# EasyEDA Pro project ProPrj_KrabbyUno - v0.1_2026-05-19.epro, board PCB1
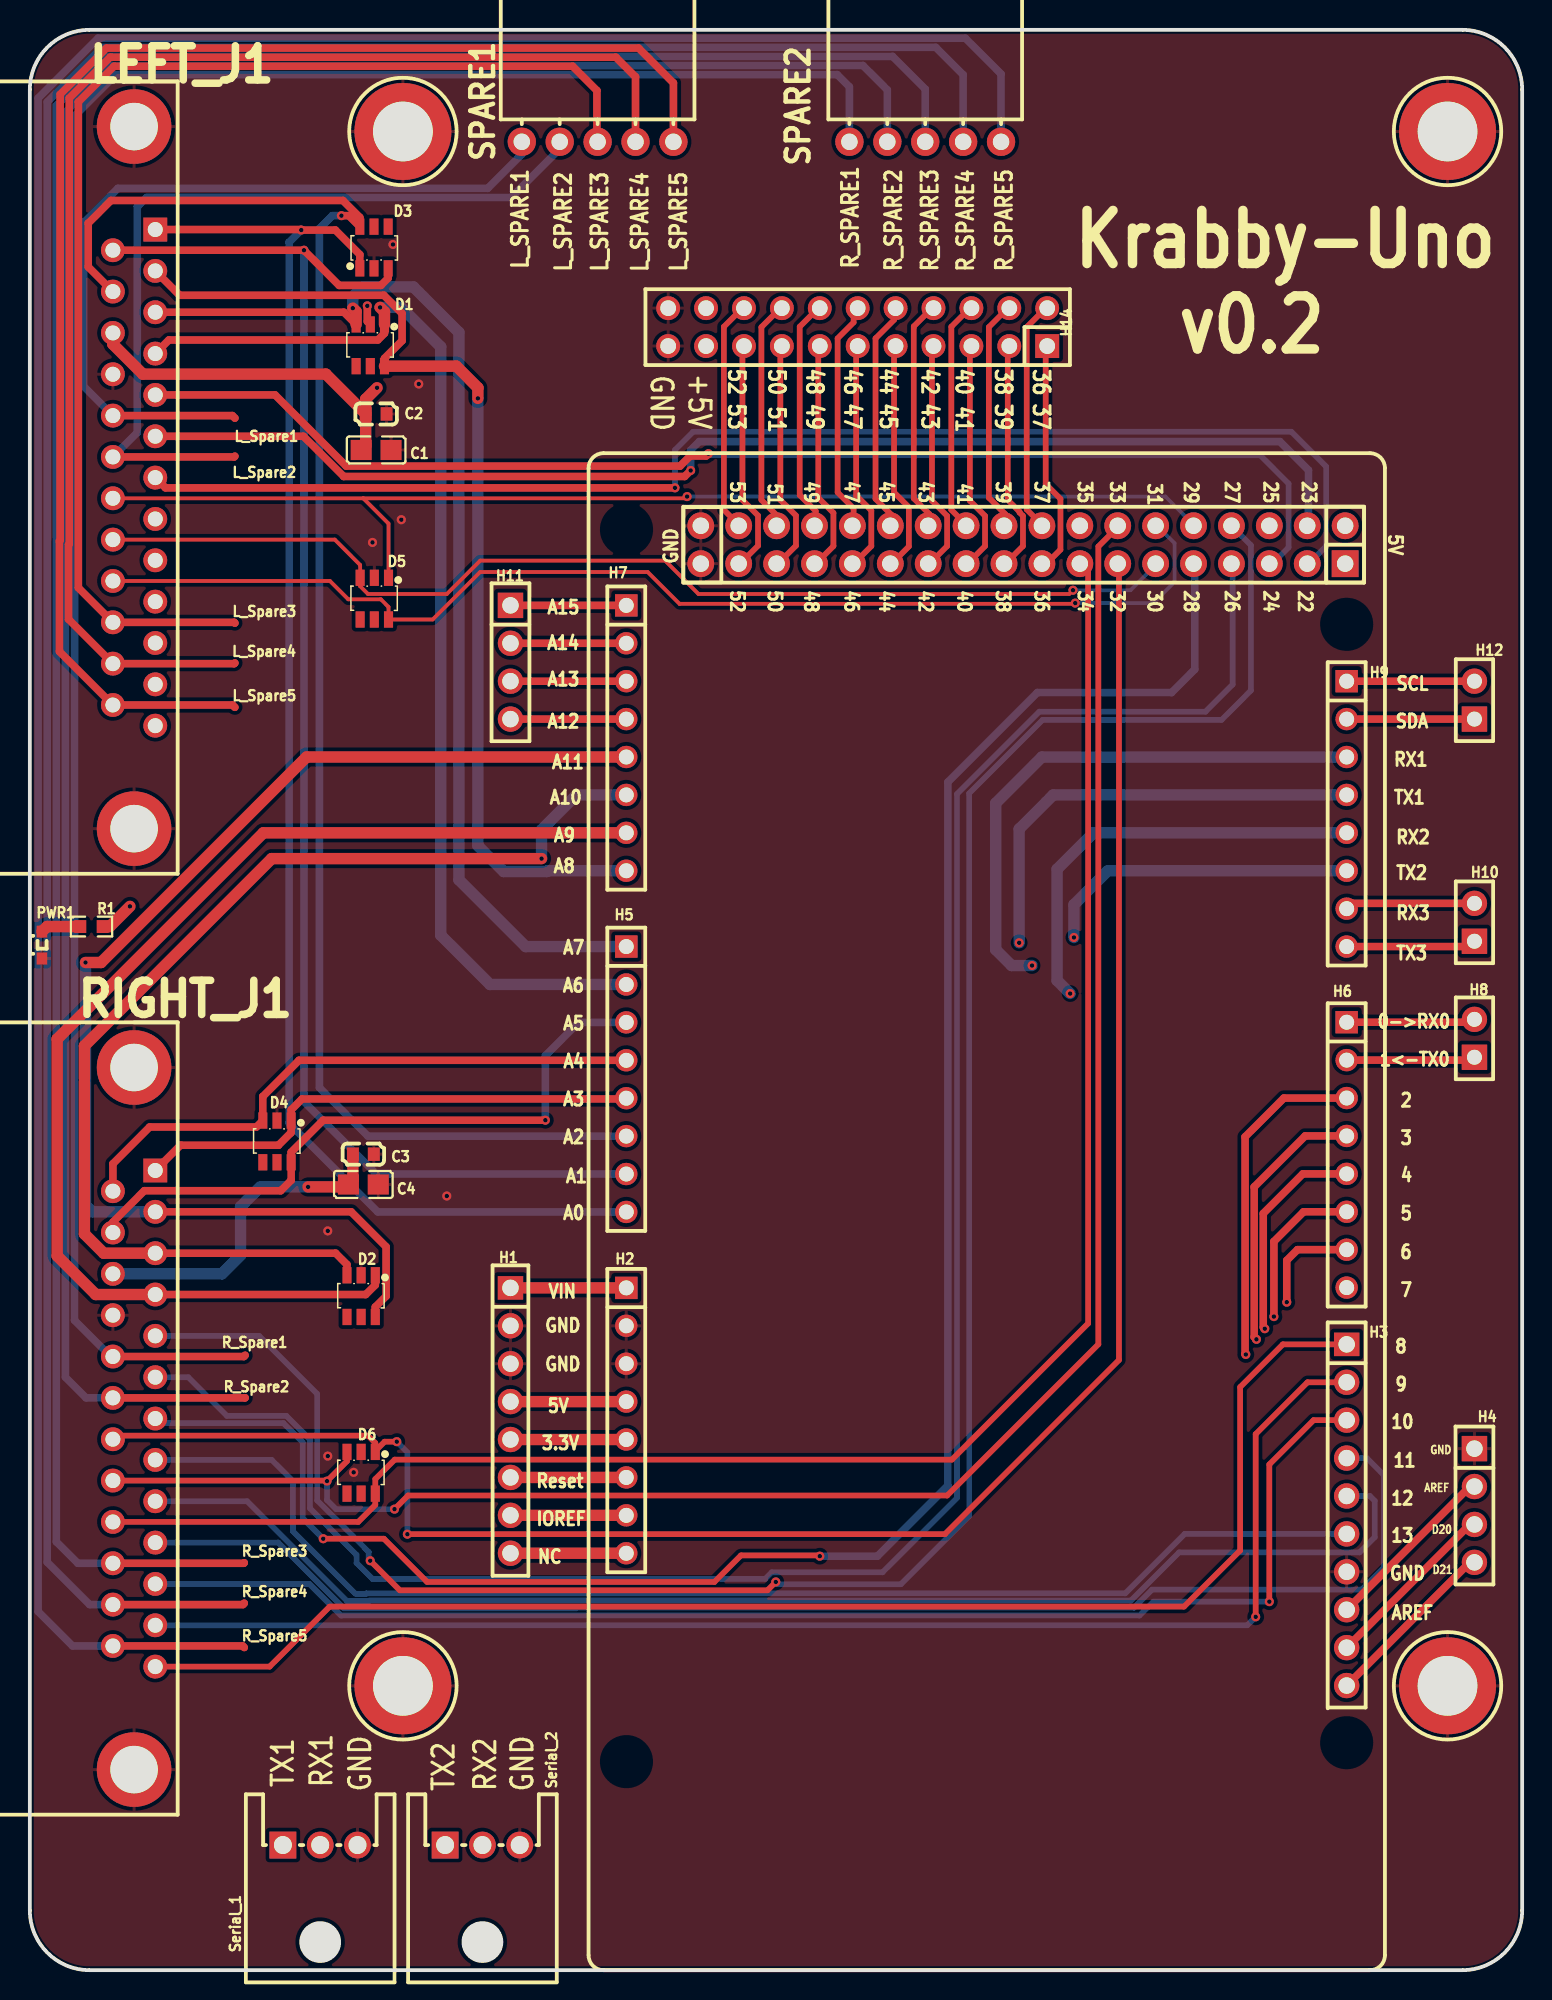
[diagram p6: board, top side]
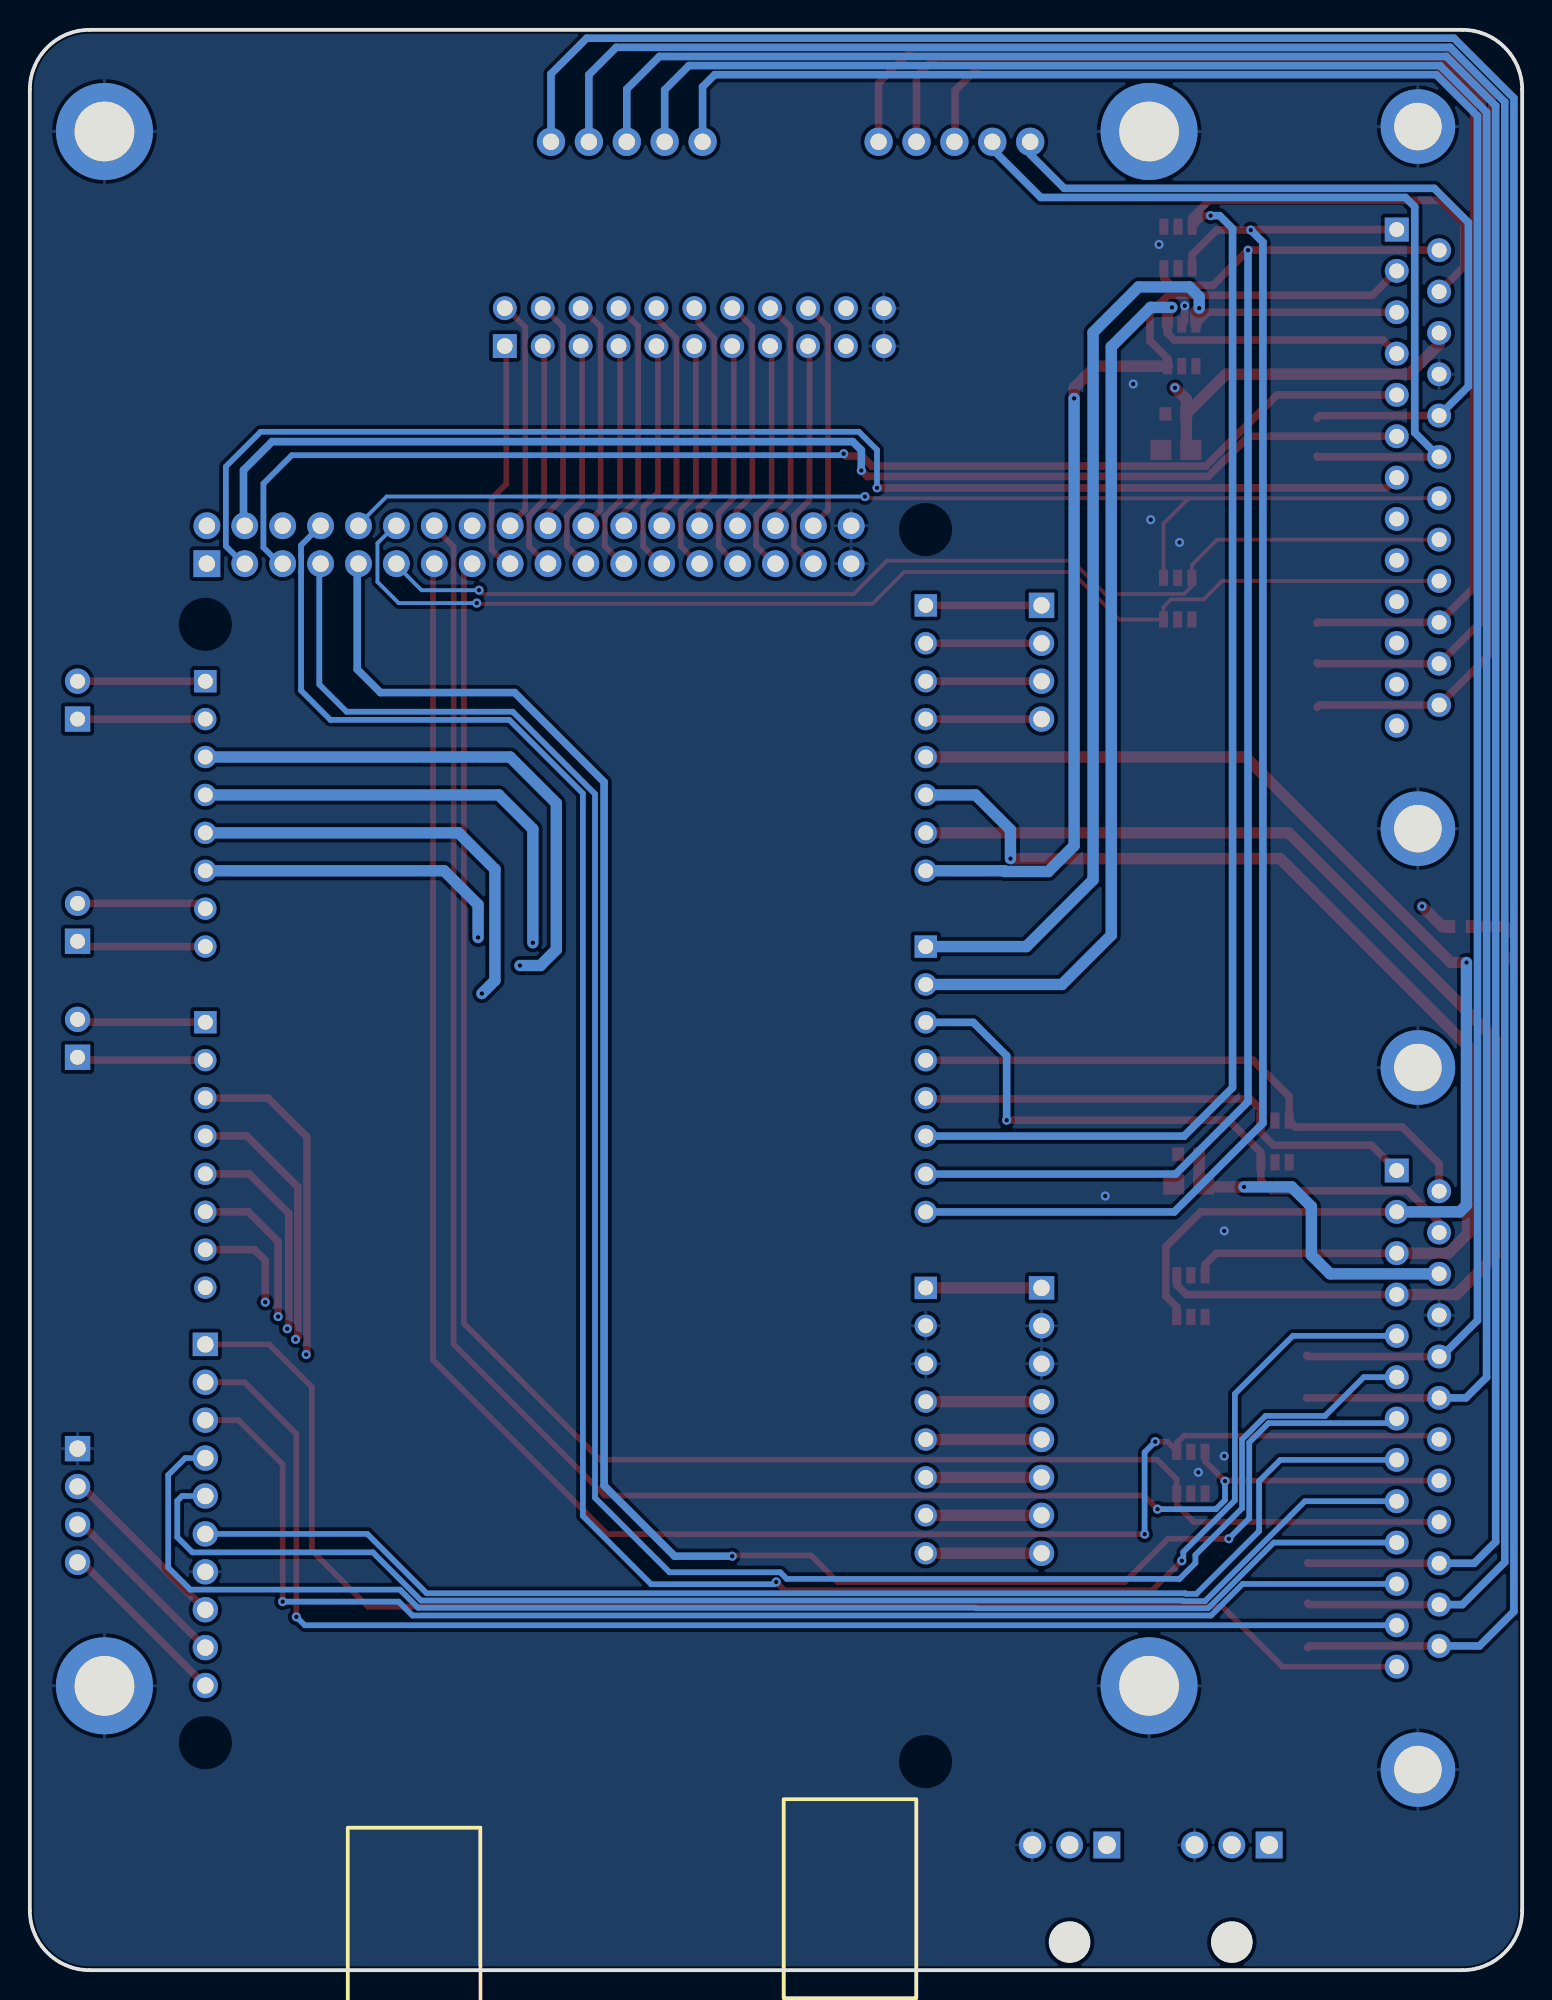
[diagram p7: board, bottom side, seen from below]

Outline 100 x 130 mm; copper layers: Top Layer, Inner1, Inner2, Bottom Layer. Coordinates in mm from the lower left corner of the outline.
Outline path: 0,126 0,4 arc(1.17,1.17) 4,0 96,0 arc(98.83,1.17) 100,4 100,126 arc(98.83,128.83) 96,130 4,130 arc(1.17,128.83) 0,126
Stack: Top Layer 0.035mm Outer layer thickness 1oz / Dielectric1 0.2104mm 7628 RC49% 8.6mil / Inner1 0.0152mm Inner layer thickness / Dielectric2 1.065mm 1.1mm H/HOZ Copper / Inner2 0.0152mm Inner layer thickness / Dielectric3 0.2104mm 7628 RC49% 8.6mil / Bottom Layer 0.035mm Outer layer thickness 1oz

## Design rules (mm)
template: JLCPCB Capability(Two Layers Board)
spacing copperThickness1oz (default): track to track 0.102, other pairs 0.152 to 0.3
spacing copperThickness2oz: track to track 0.203, other pairs 0.152 to 0.3
track width copperThickness1oz (default): min 0.127, default 0.254, max 2.54
track width copperThickness2oz: min 0.203, default 0.254, max 2.54
differential pair differentialPair (default): width min 0.127, default 0.254, max 2.54; gap min 0.152, default 0.152
via viaSize (default): diameter min 0.5, default 0.61, max 10; hole min 0.3, default 0.305, max 6.3

## Placement (name value [footprint] x y rotation side)
C1  4.7uF  [C0805]  23.21 101.85 180 top
C2  100nF  [C0603]  23.21 104.27 0 top
C3  100nF  [C0603]  22.35 54.67 0 top
C4  4.7uF  [C0805]  22.35 52.64 180 top
D1  PESD5V0S5UD,115  [SC-74-6_L3.0-W1.5-P0.95-LS2.8-BL]  22.81 108.86 180 top
D2  PESD5V0S5UD,115  [SC-74-6_L3.0-W1.5-P0.95-LS2.8-BL]  22.2 45.16 180 top
D3  PESD5V0S5UD,115  [SC-74-6_L3.0-W1.5-P0.95-LS2.8-BL]  23.06 115.42 0 top
D4  PESD5V0S5UD,115  [SC-74-6_L3.0-W1.5-P0.95-LS2.8-BL]  16.56 55.52 180 top
D5  PESD5V0S5UD,115  [SC-74-6_L3.0-W1.5-P0.95-LS2.8-BL]  23.08 91.89 180 top
D6  PESD5V0S5UD,115  [SC-74-6_L3.0-W1.5-P0.95-LS2.8-BL]  22.2 33.32 180 top
H1  PM254-1-08-Z-8.5  [HDR-TH_8P-P2.54-V-F]  32.21 36.82 270 top
H2  PZ254V-11-08P  [HDR-TH_8P-P2.54-V-M]  39.97 36.82 270 top
H3  PZ254V-11-10P  [HDR-TH_10P-P2.54-V-M]  88.24 30.5 270 top
H4  PM254-1-04-Z-8.5  [HDR-TH_4P-P2.54-V-F]  96.8 31.13 270 top
H5  PZ254V-11-08P  [HDR-TH_8P-P2.54-V-M]  39.97 59.69 270 top
H6  PZ254V-11-08P  [HDR-TH_8P-P2.54-V-M]  88.24 54.62 270 top
H7  PZ254V-11-08P  [HDR-TH_8P-P2.54-V-M]  39.97 82.55 270 top
H8  PM254-1-02-Z-8.5  [HDR-TH_2P-P2.54-V-F]  96.8 62.43 90 top
H9  PZ254V-11-08P  [HDR-TH_8P-P2.54-V-M]  88.24 77.47 270 top
H10  PM254-1-02-Z-8.5  [HDR-TH_2P-P2.54-V-F]  96.8 70.21 90 top
H11  PM254-1-04-Z-8.5  [HDR-TH_4P-P2.54-V-F]  32.21 87.63 270 top
H12  PM254-1-02-Z-8.5  [HDR-TH_2P-P2.54-V-F]  96.8 85.09 90 top
H13  PZ254-2-18-Z-8.5  [HDR-TH_36P-P2.54-V-M-R2-C18-S2.54]  66.55 95.5 0 top
H14  PM254-2-11-Z-8.5  [HDR-TH_22P-P2.54-V-F-R2-C11-S2.54]  55.47 110.08 0 top
L_Spare1  -  [Test-Point-0.5mm]  13.74 103.99 90 top
L_Spare2  -  [Test-Point-0.5mm]  13.74 101.43 90 top
L_Spare3  -  [Test-Point-0.5mm]  13.74 90.25 0 top
L_Spare4  -  [Test-Point-0.5mm]  13.74 87.58 0 top
L_Spare5  -  [Test-Point-0.5mm]  13.74 84.61 0 top
LEFT_J1  D-DMR025PM-D002  [DB25-TH_DMR025PM000XH00]  6.98 100 270 top
M1  SMTSO2025CTJ  [SMD-1_BD6.2-D3.6]  25 123.19 270 top
M2  SMTSO2025CTJ  [SMD-1_BD6.2-D3.6]  25 19.05 270 top
M3  SMTSO2025CTJ  [SMD-1_BD6.2-D3.6]  95 123.19 270 top
M4  SMTSO2025CTJ  [SMD-1_BD6.2-D3.6]  95 19.05 270 top
PWR1  LTST-S270TGKT  [LED-SMD_L1.7-W0.6-RD_GREEN]  0.81 68.68 90 top
R1  4.7K  [R0603]  4.13 69.92 180 top
R_Spare1  -  [Test-Point-0.5mm]  14.42 41.19 90 top
R_Spare2  -  [Test-Point-0.5mm]  14.42 38.35 90 top
R_Spare3  -  [Test-Point-0.5mm]  14.37 27.29 0 top
R_Spare4  -  [Test-Point-0.5mm]  14.37 24.58 0 top
R_Spare5  -  [Test-Point-0.5mm]  14.37 21.62 0 top
RIGHT_J1  D-DMR025PM-D002  [DB25-TH_DMR025PM000XH00]  6.98 36.96 270 top
Serial_1  S03B-XASK-1(LF)(SN)  [CONN-TH_S03B-XASK-1]  19.46 8.38 0 top
Serial_2  S03B-XASK-1(LF)(SN)  [CONN-TH_S03B-XASK-1]  30.33 8.38 0 top
SPARE1  BX-PM2.54-1-5PWZ  [HDR-TH_5P-P2.54-H-F-W10.0-N]  38.05 122.5 180 top
SPARE2  BX-PM2.54-1-5PWZ  [HDR-TH_5P-P2.54-H-F-W10.0-N]  60 122.5 180 top

## Footprints (pads in the part's own frame, mm; a bottom-side part is the same pattern mirrored in y, then rotated)
C0603
  rect 0.8x0.9 smd: 1(-0.7,0) 2(0.7,0)
C0805
  rect 1.41x1.35 smd: 1(-1,0) 2(1,0)
CONN-TH_S03B-XASK-1
  rect 1.8x1.8 hole 1.2: 1(-2.5,0)
  round 1.8 hole 1.2: 2(0,0) 3(2.5,0)
DB25-TH_DMR025PM000XH00
  rect 1.6x1.6 hole 1: 1(-16.62,1.42)
  round 1.6 hole 1: 2(-13.85,1.42) 3(-11.08,1.42) 4(-8.31,1.42) 5(-5.54,1.42) 6(-2.77,1.42) 7(0,1.42) 8(2.77,1.42) 9(5.54,1.42) 10(8.31,1.42) 11(11.08,1.42) 12(13.85,1.42) 13(16.62,1.42) 14(-15.235,-1.42) 15(-12.465,-1.42) 16(-9.695,-1.42) 17(-6.925,-1.42) 18(-4.155,-1.42) 19(-1.385,-1.42) 20(1.385,-1.42) 21(4.155,-1.42) 22(6.925,-1.42) 23(9.695,-1.42) 24(12.465,-1.42) 25(15.235,-1.42)
  round 5 hole 3.18: 26(23.52,0) 27(-23.52,0)
HDR-TH_2P-P2.54-V-F
  rect 1.7x1.7 hole 1: 1(-1.27,0)
  round 1.7 hole 1: 2(1.27,0)
HDR-TH_4P-P2.54-V-F
  rect 1.7x1.7 hole 1.1: 1(-3.81,0)
  round 1.7 hole 1.1: 2(-1.27,0) 3(1.27,0) 4(3.81,0)
HDR-TH_5P-P2.54-H-F-W10.0-N
  round 1.9 hole 1.1: 1(-5.08,0) 2(-2.54,0) 3(0,0) 4(2.54,0) 5(5.08,0)
HDR-TH_8P-P2.54-V-F
  rect 1.575x1.7 hole 1.1: 1(-8.89,0)
  round 1.7 hole 1.1: 2(-6.35,0) 3(-3.81,0) 4(-1.27,0) 5(1.27,0) 6(3.81,0) 7(6.35,0) 8(8.89,0)
HDR-TH_8P-P2.54-V-M
  rect 1.5x1.5 hole 1: 1(-8.89,0)
  round 1.5 hole 1: 2(-6.35,0) 3(-3.81,0) 4(-1.27,0) 5(1.27,0) 6(3.81,0) 7(6.35,0) 8(8.89,0)
HDR-TH_10P-P2.54-V-M
  rect 1.575x1.7 hole 1.1: 1(-11.43,0)
  round 1.7 hole 1.1: 2(-8.89,0) 3(-6.35,0) 4(-3.81,0) 5(-1.27,0) 6(1.27,0) 7(3.81,0) 8(6.35,0) 9(8.89,0) 10(11.43,0)
HDR-TH_22P-P2.54-V-F-R2-C11-S2.54
  rect 1.6x1.6 hole 1.05: 1(12.7,-1.27)
  round 1.6 hole 1.05: 2(12.7,1.27) 3(10.16,-1.27) 4(10.16,1.27) 5(7.62,-1.27) 6(7.62,1.27) 7(5.08,-1.27) 8(5.08,1.27) 9(2.54,-1.27) 10(2.54,1.27) 11(0,-1.27) 12(0,1.27) 13(-2.54,-1.27) 14(-2.54,1.27) 15(-5.08,-1.27) 16(-5.08,1.27) 17(-7.62,-1.27) 18(-7.62,1.27) 19(-10.16,-1.27) 20(-10.16,1.27) 21(-12.7,-1.27) 22(-12.7,1.27)
HDR-TH_36P-P2.54-V-M-R2-C18-S2.54
  rect 1.8x1.8 hole 1.1: 1(21.59,-1.27)
  round 1.8 hole 1.1: 2(21.59,1.27) 3(19.05,-1.27) 4(19.05,1.27) 5(16.51,-1.27) 6(16.51,1.27) 7(13.97,-1.27) 8(13.97,1.27) 9(11.43,-1.27) 10(11.43,1.27) 11(8.89,-1.27) 12(8.89,1.27) 13(6.35,-1.27) 14(6.35,1.27) 15(3.81,-1.27) 16(3.81,1.27) 17(1.27,-1.27) 18(1.27,1.27) 19(-1.27,-1.27) 20(-1.27,1.27) 21(-3.81,-1.27) 22(-3.81,1.27) 23(-6.35,-1.27) 24(-6.35,1.27) 25(-8.89,-1.27) 26(-8.89,1.27) 27(-11.43,-1.27) 28(-11.43,1.27) 29(-13.97,-1.27) 30(-13.97,1.27) 31(-16.51,-1.27) 32(-16.51,1.27) 33(-19.05,-1.27) 34(-19.05,1.27) 35(-21.59,-1.27) 36(-21.59,1.27)
LED-SMD_L1.7-W0.6-RD_GREEN
  rect 0.8x0.7 smd: 1(-0.9,0) 2(0.9,0)
R0603
  rect 0.806x0.864 smd: 1(-0.753,0) 2(0.753,0)
SC-74-6_L3.0-W1.5-P0.95-LS2.8-BL
  rect 0.61x1.092 smd: 1(-0.95,-1.397) 2(0,-1.397) 3(0.95,-1.397) 4(0.95,1.397) 5(0,1.397) 6(-0.95,1.397)
SMD-1_BD6.2-D3.6
  round 6.5 hole 4: 1(0,0)
Test-Point-0.5mm
  round 0.5 smd: 1(0,0)

## Nets
As in the schematic.

Pads without a net: D1 4 5; D2 4 5; D3 4 5; D4 4 5; D5 4 5; D6 4 5; H13 6 16

## Via types
v1: diameter 0.61, hole 0.305, Top Layer to Bottom Layer, 46 vias

## Routing (per net, layer and track width the routed paths; a pad name or vN(x,y) marks a point on that pad's centre or on a via; arc(x,y) is an arc through that point)
+5V: length 242.9
  Top Layer w0.762: C2.1 22.51,102.15 C1.2 ; C2.1 19.84,106.93 7.57,106.93 5.56,108.94 LEFT_J1.16 ; C2.1 22.51,105.26 v1(23.27,106.02) ; v1(6.71,71.27) 5.35,69.92 R1.1 ; H1.4 H2.4 ; v1(18.64,52.48) 21.18,52.48 C4.2 21.65,52.94 C3.1
  Inner2 w0.762: H1.4 21.19,38.09 18.64,40.64 v1(18.64,52.48) 18.64,66.4 13.77,71.27 v1(6.71,71.27) 3.76,74.22 3.76,107.89 LEFT_J1.16 ; 88.22,94.22 88.22,111.27 85.95,113.54 46.43,113.54 45.31,112.42 H14.20 H14.19 45.31,106.27 42.93,103.89 25.4,103.89 v1(23.27,106.02)
  Bottom Layer w0.762: v1(18.64,52.48) 15.44,52.48 14.12,51.16 14.12,47.9 12.87,46.65 RIGHT_J1.16
GND: length 1.3
  Top Layer w0.508: D1.2 22.61,110.46 v1(22.61,111.51)
  vias: v1(19.96,49.53) v1(19.96,34.44) v1(21.7,33.35) v1(22.96,95.66) v1(24.33,115.62) v1(24.89,97.18) v1(26.06,106.27) v1(27.94,51.87)
AREF: length 12
  Top Layer w0.508: H4.2 96.5,32.4 H3.8
D20: length 12
  Top Layer w0.508: H4.3 96.5,29.86 H3.9
D21: length 12
  Top Layer w0.508: H4.4 96.5,27.32 H3.10
EN1: length 89.8
  Top Layer w0.508: v1(43.23,99.31) 9.09,99.31 LEFT_J1.7
  Bottom Layer w0.381: 85.68,94.22 86.87,95.41 86.87,100.74 84.53,103.07 44.45,103.07 43.23,101.85 v1(43.23,99.31)
EN2: length 84.7
  Top Layer w0.508: v1(44.28,100.48) 43.88,100.08 21.03,100.08 18.34,102.77 LEFT_J1.6
  Bottom Layer w0.508: v1(44.28,100.48) 44.28,101.84 44.86,102.41 83.77,102.41 85.68,100.5 85.68,96.76
EN3: length 85
  Top Layer w0.508: LEFT_J1.5 16.43,105.54 21.2,100.77 43.57,100.77 44.25,101.45 45.31,101.45 v1(45.47,101.6)
  Bottom Layer w0.381: 83.14,94.22 83.25,94.22 84.35,95.32 84.35,99.6 82.45,101.5 45.57,101.5 v1(45.47,101.6)
IS1: length 76.2
  Top Layer w0.508: LEFT_J1.4 9.31,109.22 23.32,109.22 23.76,109.67 D1.1
  Top Layer w0.762: D1.1 23.76,111.11 v1(23.47,111.4)
  Bottom Layer w0.762: v1(23.47,111.4) 24.89,111.4 27.53,108.76 27.53,69.34 30.84,66.04 H5.2
IS2: length 74.1
  Top Layer w0.508: D1.3 21.05,111.08 LEFT_J1.3
  Top Layer w0.762: v1(21.64,111.35) 21.86,111.13 D1.3
  Bottom Layer w0.762: v1(21.64,111.35) 21.64,112.12 22.3,112.78 25.7,112.78 28.75,109.73 28.75,73.05 33.22,68.58 H5.1
IS3: length 70
  Top Layer w0.508: LEFT_J1.2 10.04,112.22 23.72,112.22 24.94,111 24.94,109.17 23.76,107.99 D1.6
  Top Layer w0.762: D1.6 28.57,107.47 30.02,106.02 v1(30.02,105.31)
  Bottom Layer w0.762: v1(30.02,105.31) 30.02,75.34 31.75,73.61 34.65,73.61 34.7,73.66 H7.8
OPT1: length 79.4
  Top Layer w0.254: v1(44.04,98.73) 43.93,98.61 22.34,98.61 ; 22.34,98.61 LEFT_J1.20 ; 22.34,98.61 24.03,96.92 D5.1
  Bottom Layer w0.254: 78.06,96.76 76.1,98.73 v1(44.04,98.73)
OPT2: length 75
  Top Layer w0.254: LEFT_J1.21 20.44,95.84 22.13,94.15 D5.3 22.13,92.72 22.66,92.2 27.94,92.2 30.18,94.44 42.57,94.44 44.81,92.2 69.65,92.2 v1(69.9,92.46)
  Bottom Layer w0.254: 75.52,94.22 73.75,92.46 v1(69.9,92.46)
OPT3: length 79.8
  Top Layer w0.254: v1(70.05,91.59) 70,91.54 43.54,91.54 41.4,93.67 30.18,93.67 26.99,90.49 D5.6 24.03,91.33 23.52,91.85 21.34,91.85 20.11,93.08 LEFT_J1.22
  Bottom Layer w0.254: 75.52,96.76 75.55,96.76 76.71,95.61 76.71,93.02 75.29,91.59 v1(70.05,91.59)
POT1: length 100.5
  Top Layer w0.508: LEFT_J1.1 18.19,116.62 ; v1(18.19,116.59) 20.47,116.59 22.11,114.94 D3.1
  Bottom Layer w0.508: H5.8 23.32,50.8 17.37,56.74 17.37,115.77 v1(18.19,116.59)
POT2: length 100.9
  Top Layer w0.508: LEFT_J1.14 v1(18.37,115.23) 20.73,112.88 23.52,112.88 24.01,113.37 D3.3
  Bottom Layer w0.508: v1(18.37,115.23) 18.37,58.19 23.22,53.34 H5.7
POT3: length 108
  Top Layer w0.508: v1(20.88,117.55) 21.38,117.55 D3.6 22.11,117.43 20.98,118.57 5.44,118.57 3.91,117.04 3.91,114.12 LEFT_J1.15
  Bottom Layer w0.508: H5.6 22.66,55.88 19.41,59.13 19.41,116.69 20.27,117.55 v1(20.88,117.55)
PWM1_L: length 129.2
  Top Layer w0.508: 88.24,55.89 85.46,55.89 82.04,52.48 82.04,42.42 v1(82.19,42.27)
  Inner2 w0.508: LEFT_J1.12 22.56,86.15 23.77,84.94 23.77,76.61 28.7,71.68 71.58,71.68 73.56,69.7 73.56,45.01 76.3,42.27 v1(82.19,42.27)
PWM1_R: length 130.6
  Top Layer w0.508: v1(81.48,41.25) 81.43,41.3 81.43,55.83 84.03,58.43 H6.3
  Inner2 w0.508: LEFT_J1.13 21.42,83.38 23.16,81.64 23.16,76.25 28.35,71.07 71.32,71.07 72.95,69.45 72.95,44.76 76.45,41.25 v1(81.48,41.25)
PWM2_L: length 126.2
  Top Layer w0.508: H6.6 85.35,50.81 83.36,48.82 v1(83.36,43.79)
  Inner2 w0.508: v1(83.36,43.79) 77.78,43.79 75.59,45.97 75.59,70.56 71.22,74.93 34.84,74.93 34.58,75.18 29.57,75.18 25.4,79.35 25.4,90.07 23.78,91.69 LEFT_J1.10
PWM2_R: length 128.5
  Top Layer w0.508: H6.5 85.3,53.35 82.65,50.7 82.65,43.08 v1(82.75,42.98)
  Inner2 w0.508: LEFT_J1.11 22.89,88.92 24.38,87.43 24.38,76.86 28.96,72.29 71.83,72.29 74.17,69.95 74.17,45.26 76.25,43.18 82.55,43.18 v1(82.75,42.98)
PWM3_L: length 121.9
  Inner2 w0.508: H6.8 79.8,45.73 77.93,47.6 77.93,71.73 69.65,80.01 29.06,80.01 27.03,82.04 27.03,93.37 23.17,97.23 LEFT_J1.8
PWM3_R: length 124.6
  Top Layer w0.508: v1(84.23,44.75) 84.23,47.56 84.94,48.27 H6.7
  Inner2 w0.508: v1(84.23,44.75) 78.08,44.75 76.4,46.43 76.4,71.32 70.26,77.47 28.91,77.47 26.42,79.96 26.42,91.03 22.99,94.46 LEFT_J1.9
R_EN1: length 137.2
  Top Layer w0.381: v1(52.93,27.74) 52.88,27.79 47.65,27.79 45.87,26.01 26.62,26.01 23.72,28.91 v1(19.66,28.91)
  Bottom Layer w0.381: v1(19.66,28.91) 18.29,30.28 18.29,35.36 16.99,36.65 8.71,36.65 RIGHT_J1.7
  Bottom Layer w0.508: v1(52.93,27.74) 56.79,27.74 61.52,32.46 61.52,79.6 67.51,85.6 76.5,85.6 78.06,87.16 78.06,94.22
R_EN2: length 141.3
  Bottom Layer w0.381: RIGHT_J1.6 10.62,39.73 13.21,37.13 17.19,37.13 18.77,35.56 18.77,30.94 21.89,27.82 21.89,27.28 22.96,26.21 49.27,26.21 49.72,26.66 57.14,26.66 62.13,31.65 62.13,78.8 67.64,84.32 78.78,84.32 80.6,86.14 80.6,94.22
R_EN3: length 150
  Top Layer w0.381: v1(49.99,26.01) 49.43,25.45 24.79,25.45 v1(22.81,27.43)
  Bottom Layer w0.381: 80.52,96.78 81.82,95.47 81.82,94.76 81.82,94.75 81.82,93.72 81.82,93.71 81.82,85.74 79.86,83.77 67.87,83.77 62.94,78.84 62.94,30.43 58.37,25.86 50.14,25.86 v1(49.99,26.01) ; RIGHT_J1.5 15.36,42.5 19.25,38.61 19.25,31.47 22.71,28.02 22.71,27.53 v1(22.81,27.43)
R_IS1: length 81.7
  Top Layer w0.508: D2.1 23.15,45.91 22.51,45.27 RIGHT_J1.4
  Top Layer w0.762: RIGHT_J1.4 4.42,45.27 1.83,47.85 1.83,62.38 15.65,76.2 H7.7
R_IS2: length 75.9
  Top Layer w0.508: D2.3 21.25,47.28 20.49,48.04 RIGHT_J1.3
  Top Layer w0.762: RIGHT_J1.3 4.95,48.04 3.66,49.33 3.66,59.51 ; v1(34.29,74.47) 16.2,74.47 3.66,61.92 3.66,59.74
  Bottom Layer w0.762: H7.6 36.63,78.74 34.29,76.4 v1(34.29,74.47)
R_IS3: length 84.5
  Top Layer w0.508: D2.6 23.15,44.44 23.88,45.16 23.88,48.46 21.53,50.81 8.41,50.81
  Top Layer w0.762: H7.5 18.54,81.28 4.78,67.51 v1(3.73,67.51)
  Bottom Layer w0.762: 8.41,50.81 4.18,50.81 3.73,51.26 v1(3.73,67.51)
R_OPT1: length 132.5
  Top Layer w0.381: 23.15,34.78 23.15,35.32 22.66,35.81 5.81,35.81 RIGHT_J1.20 ; 23.15,34.78 23.77,35.41 v1(24.59,35.41) ; 23.15,34.78 D6.1 ; 72.98,94.22 72.98,40.88 61.32,29.21 v1(25.3,29.21)
  Bottom Layer w0.381: v1(24.59,35.41) 25.3,34.7 v1(25.3,29.21)
R_OPT2: length 130.1
  Top Layer w0.381: 19.95,32.8 21.25,34.1 D6.3 ; 19.95,32.8 RIGHT_J1.21 ; 19.95,32.8 v1(19.91,32.77) ; v1(24.44,30.89) 25.35,31.8 61.47,31.8 71.6,41.93 71.6,95.38 72.98,96.76
  Bottom Layer w0.381: v1(24.44,30.89) 20.52,30.89 19.91,31.5 v1(19.91,32.77)
R_OPT3: length 123
  Top Layer w0.381: RIGHT_J1.22 22.01,30.03 23.15,31.18 D6.6 23.15,32.9 24.45,34.2 61.79,34.2 70.92,43.33 70.92,93.75 70.44,94.22
R_POT1: length 34.5
  Top Layer w0.508: H5.5 39.92,58.37 18.24,58.37 17.51,57.64 D4.1 17.51,56.12 16.66,55.27 10.1,55.27 RIGHT_J1.1
R_POT2: length 40.1
  Top Layer w0.508: H5.4 18.03,60.96 15.61,58.54 D4.3 15.18,56.49 8.03,56.49 5.56,54.03 RIGHT_J1.14
R_POT3: length 44.3
  Top Layer w0.508: v1(34.54,56.95) 19.66,56.95 17.51,54.8 D4.6 17.51,52.92 16.81,52.22 7.67,52.22 5.56,50.12 RIGHT_J1.15
  Bottom Layer w0.508: H5.3 36.78,63.5 34.54,61.27 v1(34.54,56.95)
R_PWM1_L: length 93.8
  Top Layer w0.381: v1(82.14,23.67) 82.14,35.92 85.62,39.39 H3.2
  Bottom Layer w0.381: RIGHT_J1.12 81.58,23.11 v1(82.14,23.67)
R_PWM1_R: length 95.2
  Top Layer w0.381: RIGHT_J1.13 16.07,20.34 20.09,24.36 77.34,24.36 81.1,28.12 81.1,39.06 83.97,41.93 H3.1
R_PWM2_L: length 94.4
  Bottom Layer w0.381: H3.4 89.59,34.31 90.73,33.17 90.73,26.97 89.25,25.5 75.2,25.5 73.99,24.28 36.63,24.28 36.59,24.24 21.05,24.24 16.64,28.65 RIGHT_J1.10
R_PWM2_R: length 91.5
  Top Layer w0.381: H3.3 86.02,36.85 83.06,33.88 v1(83.06,24.69)
  Bottom Layer w0.381: v1(83.06,24.69) 75.29,24.69 74.36,23.76 20.85,23.76 18.73,25.88 RIGHT_J1.11
R_PWM3_L: length 87.2
  Bottom Layer w0.381: H3.6 77.39,29.23 73.41,25.25 22.56,25.25 22.52,25.21 21.83,25.21 17.63,29.41 17.63,32.77 16.21,34.19 8.41,34.19
R_PWM3_R: length 90.7
  Bottom Layer w0.381: RIGHT_J1.9 14.56,31.42 21.25,24.73 22.72,24.73 22.76,24.76 73.79,24.76 77.01,27.99 89.1,27.99 90.12,29.01 90.12,31.44 89.8,31.77 H3.5
R_SPARE1: length 150.3
  Top Layer w0.508: RIGHT_J1.18 14.34,41.11 R_Spare1.1
  Bottom Layer w0.508: RIGHT_J1.18 5.42,41.11 2.99,43.54 2.99,124.23 5.76,127 54.1,127 54.92,126.18 SPARE2.5
R_SPARE2: length 157.9
  Top Layer w0.508: RIGHT_J1.19 14.42,38.34 R_Spare2.1
  Bottom Layer w0.508: RIGHT_J1.19 3.77,38.34 2.38,39.73 2.38,124.48 5.51,127.61 55.83,127.61 57.46,125.98 SPARE2.4
R_SPARE3: length 173.4
  Top Layer w0.508: R_Spare3.1 14.33,27.26 RIGHT_J1.23
  Bottom Layer w0.508: SPARE2.3 60,126.03 57.81,128.22 5.08,128.22 1.77,124.91 1.77,28.7 3.21,27.26 RIGHT_J1.23
R_SPARE4: length 180.4
  Top Layer w0.508: RIGHT_J1.24 14.28,24.49 R_Spare4.1
  Bottom Layer w0.508: RIGHT_J1.24 4.01,24.49 1.16,27.34 1.16,125.17 4.82,128.83 60.71,128.83 62.54,127 SPARE2.2
R_SPARE5: length 187.9
  Top Layer w0.508: RIGHT_J1.25 14.26,21.72 R_Spare5.1
  Bottom Layer w0.508: SPARE2.1 65.08,127.05 62.69,129.44 4.57,129.44 0.55,125.42 0.55,24.03 2.86,21.72 RIGHT_J1.25
RX1: length 136.1
  Inner2 w0.762: Serial_1.2 19.46,12.29 21.18,14.02 31.29,14.02 41.2,23.93 65.08,23.93 67.16,26.01 v1(67.16,67.31)
  Bottom Layer w0.762: v1(67.16,67.31) 65.79,67.31 64.72,68.38 64.72,78.18 67.82,81.28 H9.3
RX2: length 116.5
  Inner2 w0.762: Serial_2.2 30.33,10.61 41.92,22.2 65.79,22.2 69.71,26.12 v1(69.71,65.43)
  Bottom Layer w0.762: v1(69.71,65.43) 68.83,66.31 68.83,73.76 71.27,76.2 H9.5
RX3: length 8.7
  Top Layer w0.508: H9.7 88.6,71.48 H10.2
SCL: length 8.6
  Top Layer w0.508: H12.2 H9.1
SDA: length 8.6
  Top Layer w0.508: H9.2 H12.1
SPARE1: length 54.1
  Top Layer w0.508: LEFT_J1.18 13.57,104.16 L_Spare1.1
  Bottom Layer w0.508: SPARE1.5 32.97,121.66 30.68,119.38 5.89,119.38 3.6,117.09 3.6,106.12 LEFT_J1.18
SPARE2: length 56
  Top Layer w0.508: LEFT_J1.19 13.69,101.39 L_Spare2.1
  Bottom Layer w0.508: SPARE1.4 35.51,122.02 32.26,118.77 7.82,118.77 7.2,118.15 7.2,103.02 LEFT_J1.19
SPARE3: length 83.9
  Top Layer w0.508: SPARE1.3 38,122.55 38,125.93 36.37,127.56 5.64,127.56 3.25,125.17 3.25,92.62 LEFT_J1.23 13.69,90.31 L_Spare3.1
SPARE4: length 91.3
  Top Layer w0.508: SPARE1.2 40.59,126.85 39.27,128.17 5.39,128.17 2.64,125.42 2.64,95.55 2.59,95.5 2.59,90.51 LEFT_J1.24 13.69,87.53 L_Spare4.1
SPARE5: length 97.9
  Top Layer w0.508: L_Spare5.1 13.58,84.77 LEFT_J1.25 1.98,88.35 1.98,95.76 2.03,95.81 2.03,125.68 5.13,128.78 40.79,128.78 43.13,126.44 SPARE1.1
TX1: length 132.3
  Inner2 w0.762: Serial_1.1 16.96,12.69 19.15,14.88 30.94,14.88 40.84,24.79 64.72,24.79 66.29,26.37 v1(66.29,68.83)
  Bottom Layer w0.762: v1(66.29,68.83) 66.29,76.45 68.58,78.74 H9.4
TX2: length 115.2
  Inner2 w0.762: Serial_2.1 27.83,11.88 29.11,13.16 31.65,13.16 41.56,23.06 65.44,23.06 68.68,26.31 68.68,67.91 v1(69.96,69.19)
  Bottom Layer w0.762: v1(69.96,69.19) 69.96,71.39 72.24,73.66 H9.6
TX3: length 8.7
  Top Layer w0.508: H10.1 96.45,68.58 H9.8
$1N20121: length 2.7
  Top Layer w0.762: R1.2 1.15,69.92 PWR1.2
$1N20679: length 8.6
  Top Layer w0.508: H6.1 96.61,63.51 H8.2
$1N20691: length 8.6
  Top Layer w0.508: 88.24,60.97 96.61,60.97 H8.1
$1N21733: length 7.8
  Top Layer w0.508: H7.1 H11.1
$1N21737: length 7.8
  Top Layer w0.508: H7.2 H11.2
$1N21742: length 7.8
  Top Layer w0.508: H7.3 H11.3
$1N21747: length 7.8
  Top Layer w0.508: H11.4 H7.4
$1N21820: length 7.8
  Top Layer w0.762: H1.5 H2.5
$1N21825: length 7.8
  Top Layer w0.762: H2.8 H1.8
$1N21830: length 7.8
  Top Layer w0.762: H1.7 H2.7
$1N21836: length 7.8
  Top Layer w0.762: H2.6 H1.6
$1N23731: length 7.8
  Top Layer w0.762: H1.1 H2.1
$1N24030: length 15.6
  Top Layer w0.381: 67.9,94.22 68.11,94.22 69.06,95.17 69.06,98.58 68.07,99.57 68.07,108.81
$1N24036: length 15.6
  Top Layer w0.381: 67.9,96.76 66.8,97.86 66.8,110.08 68.07,111.35
$1N24042: length 15.5
  Top Layer w0.381: 65.36,94.22 66.55,95.41 66.55,97.44 66.32,97.66 66.32,97.71 65.53,98.5 65.53,108.81
$1N24048: length 15.6
  Top Layer w0.381: 65.36,96.76 65.36,97.55 64.26,98.65 64.26,110.08 65.53,111.35
$1N24054: length 15.5
  Top Layer w0.381: 62.82,94.22 64.01,95.41 64.01,97.44 62.99,98.45 62.99,108.81
$1N24060: length 15.5
  Top Layer w0.381: 62.82,96.76 61.75,97.84 61.75,110.11 62.99,111.35
$1N24066: length 15.5
  Top Layer w0.381: 60.28,94.22 61.47,95.41 61.47,97.43 60.45,98.45 60.45,108.81
$1N24072: length 15.5
  Top Layer w0.381: 60.45,111.35 59.23,110.13 59.23,98.6 60.28,97.55 60.28,96.76
$1N24078: length 15.5
  Top Layer w0.381: 57.91,108.81 57.91,99.01 58.9,98.02 58.9,95.38 57.74,94.22
$1N24084: length 15.5
  Top Layer w0.381: 57.74,96.76 57.74,97.5 56.67,98.58 56.67,109.33 57.91,110.57 57.91,111.35
$1N24090: length 15.5
  Top Layer w0.381: 55.2,94.22 56.39,95.41 56.39,97.79 55.37,98.81 55.37,108.81
$1N24096: length 15.5
  Top Layer w0.381: 55.37,111.35 55.2,111.18 55.2,110.4 54.13,109.33 54.13,99.01 55.2,97.94 55.2,96.76
$1N24102: length 15.5
  Top Layer w0.381: 52.66,94.22 53.85,95.41 53.85,97.64 52.83,98.65 52.83,108.81
$1N24108: length 15.5
  Top Layer w0.381: 52.83,111.35 51.59,110.11 51.59,98.83 52.66,97.76 52.66,96.76
$1N24124: length 15.5
  Top Layer w0.381: 50.12,94.22 51.34,95.44 51.34,97.46 50.29,98.5 50.29,108.81
$1N24129: length 15.6
  Top Layer w0.381: 50.29,111.35 49.02,110.08 49.02,98.5 50.12,97.4 50.12,96.76
$1N24135: length 15.5
  Top Layer w0.381: 47.58,94.22 48.8,95.44 48.8,97.46 47.75,98.5 47.75,108.81
$1N24141: length 15.5
  Top Layer w0.381: 47.75,111.35 46.51,110.11 46.51,97.84 47.58,96.76

## Copper pours and planes (outline as drawn; the poured copper is in the pictures)
GND on Top Layer: 0,130.18 100.08,130.18 100.08,0 0,0
GND on Bottom Layer: 0,130.18 100.08,130.18 100.08,0 0,0
GND on Inner1: 0,0 100.03,0 100.03,130 0,130
GND on Inner2: 0,130.15 100.03,130.15 100.03,0 0,0

## Text on the board
Top Silkscreen Layer: AREF | GND | D20 | D21 | 53 | 52 | 51 | 50 | 49 | 48 | 47 | 46 | 45 | 44 | 43 | 42 | 41 | 40 | 39 | 38 | 37 | 36 | 35 | 34 | 33 | 32 | 31 | 30 | 29 | 28 | 27 | 26 | 25 | 24 | 22 | 23 | 5V | Reset | IOREF | NC | 3.3V | A14 | A15 | A13 | A12 | VIN | A10 | A11 | A8 | A9 | A6 | A7 | A5 | A3 | A2 | A0 | A4 | A1 | 0->RX0 | 1<-TX0 | 10 | 12 | 13 | 11 | RX1 | TX1 | 8 | 9 | SDA | RX2 | TX2 | RX3 | TX3 | SCL | 6 | 2 | 3 | 5 | 7 | 4 | L_SPARE1 | L_SPARE2 | L_SPARE3 | L_SPARE4 | L_SPARE5 | R_SPARE1 | R_SPARE2 | R_SPARE3 | R_SPARE4 | R_SPARE5 | +5V | Krabby-Uno / v0.2
